# EAGLE schematic ATTiny-A4950 (EAGLE 6.4)
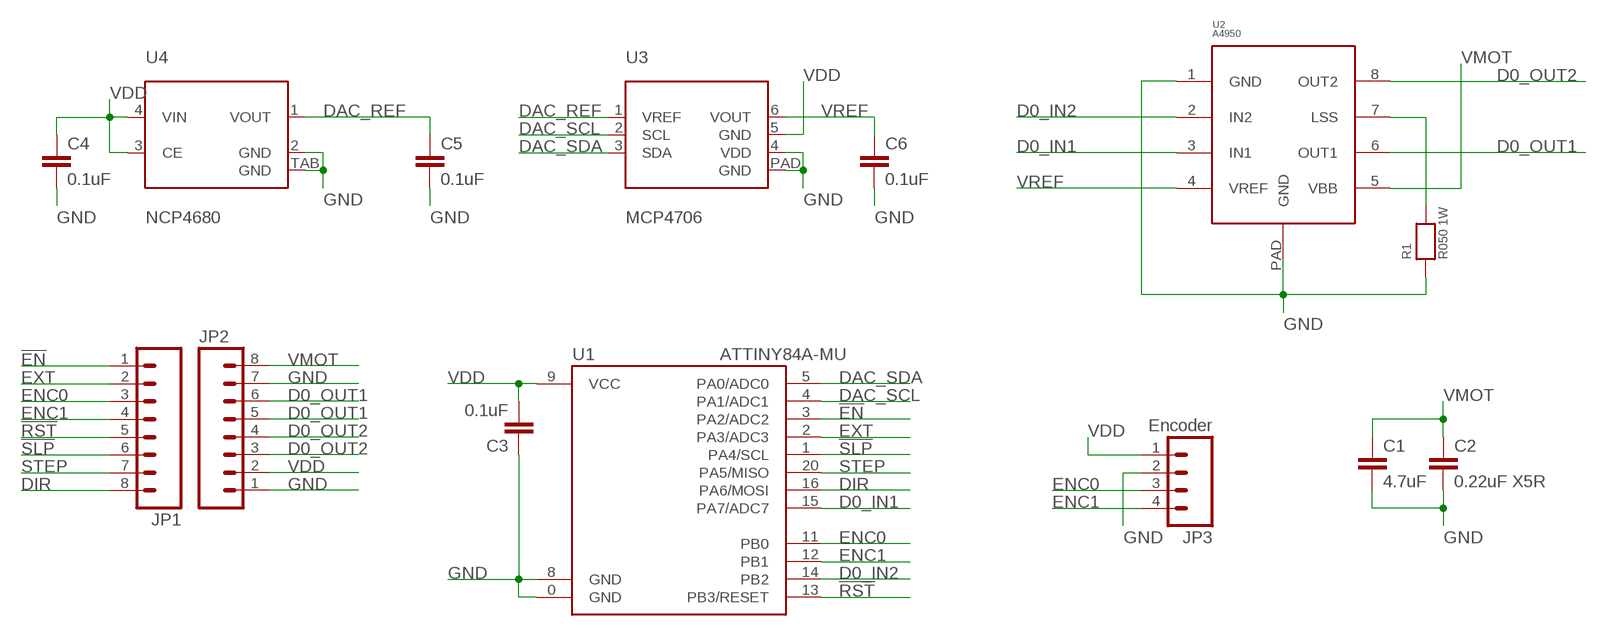
[diagram p0: schematic, sheet 1]

## Parts
C1  4.7uF  CAP1206  [1206]
C2  0.22uF X5R  CAP0402-CAP  [0402-CAP]
C3  0.1uF  CAP0402-CAP  [0402-CAP]
C4  0.1uF  CAP0402-CAP  [0402-CAP]
C5  0.1uF  CAP0402-CAP  [0402-CAP]
C6  0.1uF  CAP0402-CAP  [0402-CAP]
JP1  M081X08  [1X08]
JP2  M081X08  [1X08]
JP3  Encoder  M04PTH  [1X04]
R1  R050 1W  RESISTOR1206  [1206]
U1  ATTINY84A-MU  ATTINY24QFN  [QFN20]
U2  A4950  [SOICN8-PAD]
U3  MCP4706  MCP47X6  [6DFN]
U4  NCP4680  [XDFN4]

## Nets
!EN!: JP1.1 U1.3(PA2/ADC2)
!RST!: JP1.5 U1.13(PB3/RESET)
!SLP!: JP1.6 U1.1(PA4/SCL)
D0_IN1: U1.15(PA7/ADC7) U2.3(IN1)
D0_IN2: U1.14(PB2) U2.2(IN2)
D0_LSS: R1.2 U2.7(LSS)
D0_OUT1: JP2.5 JP2.6 U2.6(OUT1)
D0_OUT2: JP2.3 JP2.4 U2.8(OUT2)
DAC_REF: C5.1 U3.1(VREF) U4.1(VOUT)
DAC_SCL: U1.4(PA1/ADC1) U3.2(SCL)
DAC_SDA: U1.5(PA0/ADC0) U3.3(SDA)
DIR: JP1.8 U1.16(PA6/MOSI)
ENC0: JP1.3 JP3.3 U1.11(PB0)
ENC1: JP1.4 JP3.4 U1.12(PB1)
EXT: JP1.2 U1.2(PA3/ADC3)
GND: C1.2 C2.2 C3.1 C4.2 C5.2 C6.2 JP2.1 JP2.7 JP3.2 R1.1 U1.0(GND) U1.8(GND) U2.1(GND) U2.PAD(GND) U3.4(VDD) U3.PAD(GND) U4.2(GND) U4.TAB(GND)
STEP: JP1.7 U1.20(PA5/MISO)
VDD: C3.2 C4.1 JP2.2 JP3.1 U1.9(VCC) U3.5(GND) U4.3(CE) U4.4(VIN)
VMOT: C1.1 C2.1 JP2.8 U2.5(VBB)
VREF: C6.1 U2.4(VREF) U3.6(VOUT)

## Library data of the parts
C1-C6 = SparkFun-Capacitors:CAP: Capacitor Standard 0603 ceramic capacitor, and 0.1" leaded capacitor.
JP1 JP2 = SparkFun-Connectors:M08: Header 8 Standard 8-pin 0.1" header. Use with straight break away headers (SKU : PRT-00116), right angle break away headers (PRT-00553), swiss pins (PRT-00743), machine pins (PRT-00117), and female headers (PRT-00115).
JP3 = SparkFun-Connectors:M04: Header 4 Standard 4-pin 0.1" header. Use with straight break away headers (SKU : PRT-00116), right angle break away headers (PRT-00553), swiss pins (PRT-00743), machine pins (PRT-00117), and female headers (PRT-00115). Molex polarized connector foot print use with SKU : PRT-08231 with associated crimp pins and housings. 1MM SMD Version SKU: PRT-10208
R1 = microbuilder:RESISTOR: Resistors 0402 - 0402 Surface Mount Package 22 Ohm 1% 1/16W [Digikey: 311-22.0LRTR-ND] 33 Ohm 5% 1/16W 1.0K 5% 1/16W 1.5K 5% 1/16W 2.0K 1% 1/16W 10.0K 1% 1/16W [Digikey: 311-10.0KLRTR-ND] 10.0K 5% 1/16W [Digikey: RMCF0402JT10K0TR-ND] 12.1K 1% 1/16W [Digikey: 311-22.0LRTR-ND] 100.0K 5% 1/16W 0603 - 0603 Surface Mount Package 0 Ohm 1/10 Watt 1% Resistor 15 Ohm 1/10 Watt 1% Resistor 33 Ohm 1/10 Watt 1% Resistor 49.9 Ohm 1/10 Watt 1% Resistor 100 Ohm 1/10 Watt 1% Resistor 150 Ohm 1/10 Watt 1% Resistor 240 Ohm 1/10 Watt 1% Resistor 390 Ohm 1/10 Watt 1% Resistor 560 Ohm 1/10 Watt 1% Resistor 680 Ohm 1/10 Watt 1% Resistor 750 Ohm 1/10 Watt 1% Resistor 1.0K Ohm 1/10 Watt 1% Resistor 1.5K Ohm 1/10 Watt 1% Resistor 2.0K Ohm 1/10 Watt 1% Resistor 2.2K Ohm 1/10 Watt 1% Resistor 3.3K Ohm 1/10 Watt 1% Resistor 4.7K Ohm 1/10 Watt 1% Resistor 10.0K Ohm 1/10 Watt 1% Resistor 12.0K Ohm 1/10 Watt 1% Resistor 12.1K Ohm 1/10 Watt 1% Resistor 20.0K Ohm 1/10 Watt 1% Resistor 33.0K Ohm 1/10 Watt 1% Resistor 100.0K Ohm 1/10 Watt 1% Resistor 0805 - 0805 Surface Mount Package 0 Ohm 1/8 Watt 1% Resistor 33 Ohm 1/8 Watt 1% Resistor 100 Ohm 1/8 Watt 1% Resistor 150 Ohm 1/8 Watt 1% Resistor 200 Ohm 1/8 Watt 1% Resistor 240 Ohm 1/8 Watt 1% Resistor 330 Ohm 1/8 Watt 1% Resistor 390 Ohm 1/8 Watt 1% Resistor 470 Ohm 1/8 Watt 1% Resistor 1.0K Ohm 1/8 Watt 1% Resistor 1.5K Ohm 1/8 Watt 1% Resistor 2.0K Ohm 1/8 Watt 1% Resistor 4.7K Ohm 1/8 Watt 1% Resistor 5.1K Ohm 1/8 Watt 1% Resistor 5.6K Ohm 1/8 Watt 1% Resistor 10.0K Ohm 1/8 Watt 1% Resistor 22.0K Ohm 1/8 Watt 1% Resistor 33.0K Ohm 1/8 Watt 1% Resistor 100K Ohm 1/8 Watt 1% Resistor 1206 - 1206 Surface Mount Package 2012 - 2010 Surface Mount Package 0.11 Ohm 1/2 Watt 1% Resistor - Digikey: RHM.11UCT-ND
U1 = SparkFun-DigitalIC:ATTINY24: Atmel 20-pin 2kB flash uC
U2 = logxen:A4950
U3 = logxen:MCP47X6
U4 = logxen:NCP4680